# Altium project Motor_Control.PrjPcb
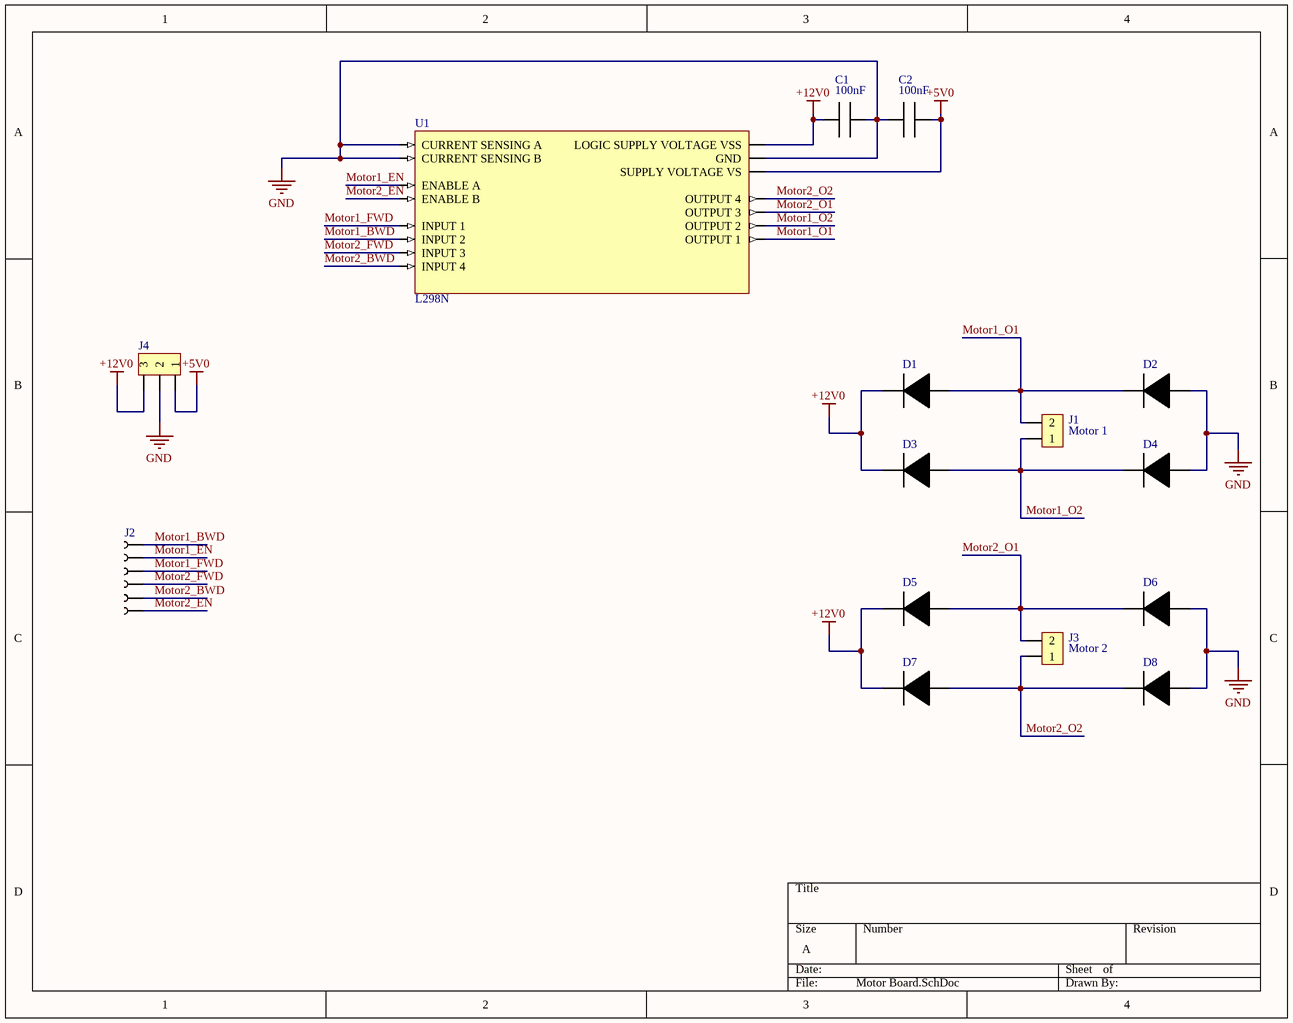
[diagram p0: Motor Board.SchDoc]
1 sheet, 15 parts. Net scope: global (net labels, ports and power ports of the same name join across sheets).
Board file: Motor Board.PcbDoc

## Sheet Motor Board.SchDoc
size A; SheetNumber: 1; SheetTotal: 1

### Parts
C1  value 100nF  [Ceramic Cap]  (hidden comment: Ceramic Capacitor)
C2  value 100nF  [Ceramic Cap]  (hidden comment: Ceramic Capacitor)
D1  Diode  [2A07]  (value not drawn)
D2  Diode  [2A07]  (value not drawn)
D3  Diode  [2A07]  (value not drawn)
D4  Diode  [2A07]  (value not drawn)
D5  Diode  [2A07]  (value not drawn)
D6  Diode  [2A07]  (value not drawn)
D7  Diode  [2A07]  (value not drawn)
D8  Diode  [2A07]  (value not drawn)
J1  Motor 1  [Terminal Block 2-pins]
J2  Headers-6  [Headers 6-pins]  (value not drawn)
J3  Motor 2  [Terminal Block 2-pins]
J4  Terminal Block 3  [Terminal Block 3]  (value not drawn)
U1  L298N  [L298N]

### Nets
+5V0: C2.2 J4.1 U1.4(SUPPLY_VOLTAGE_VS)
+12V0: C1.1 D1.2 D3.2 D5.2 D7.2 J4.3 U1.9(LOGIC_SUPPLY_VOLTAGE_VSS)
GND: C1.2 C2.1 D2.1 D4.1 D6.1 D8.1 J4.2 U1.1(CURRENT_SENSING_A) U1.8(GND) U1.15(CURRENT_SENSING_B)
Motor1_BWD: J2.1 U1.7(INPUT_2)
Motor1_EN: J2.2 U1.6(ENABLE_A)
Motor1_FWD: J2.3 U1.5(INPUT_1)
Motor1_O1: D1.1 D2.2 J1.2 U1.2(OUTPUT_1)
Motor1_O2: D3.1 D4.2 J1.1 U1.3(OUTPUT_2)
Motor2_BWD: J2.5 U1.12(INPUT_4)
Motor2_EN: J2.6 U1.11(ENABLE_B)
Motor2_FWD: J2.4 U1.10(INPUT_3)
Motor2_O1: D5.1 D6.2 J3.2 U1.13(OUTPUT_3)
Motor2_O2: D7.1 D8.2 J3.1 U1.14(OUTPUT_4)

### Library data of the parts
J1 J3 = Terminal Block 2-pins: PN: 1935161; MF: Phoenix Contact; Supplier: Digikey; Supplier PN: 277-1667-ND
D1-D8 = Diode: MF: *; MF PN: 2A07; Supplier: Electra; Supplier PN: 2A07; ComponentLink1Description: New link; ComponentLink1URL: https://electra.store/product/2a07-700v-2a-diode/
U1 = L298N: PN: L298N; Supplier: Electra; Supplier PN: *; MF: *; ComponentLink1Description: Link; ComponentLink1URL: https://electra.store/product/l298-dip-dual-full-bridge-driver/